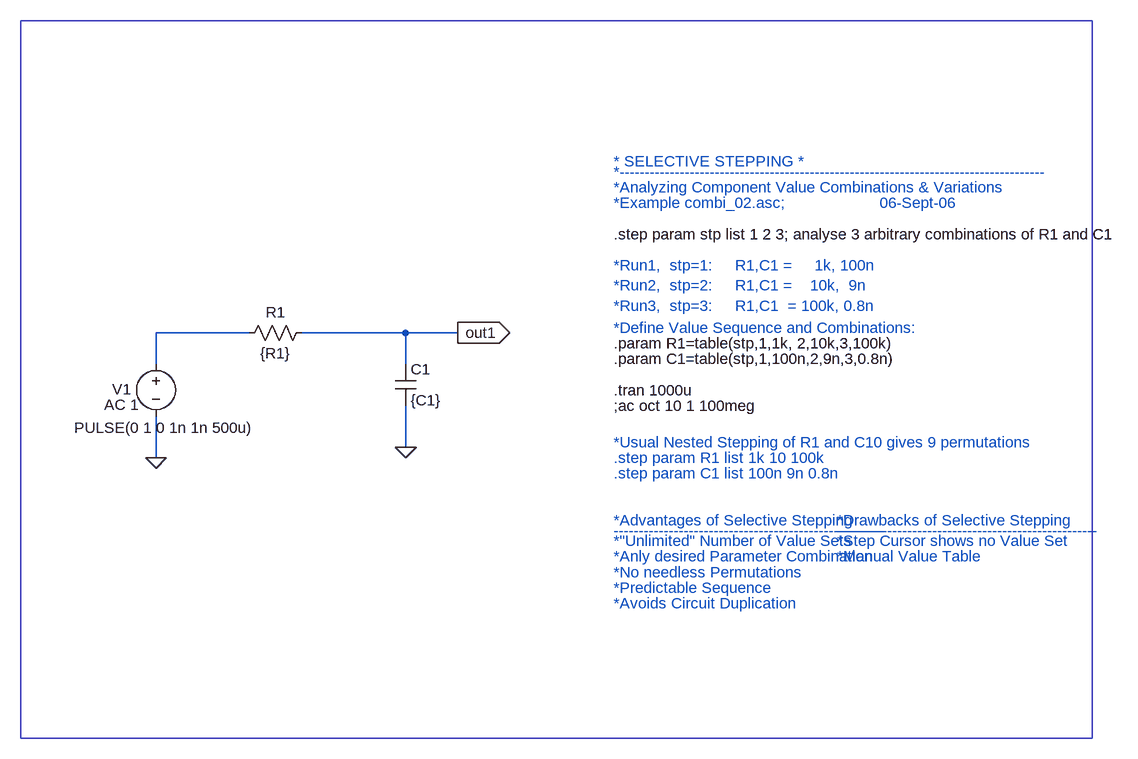
[diagram p0: schematic combi_02.asc]
combi_02.asc, the LTspice schematic file:
Version 4
SHEET 1 1020 768
WIRE -832 -64 -976 -64
WIRE -592 -64 -752 -64
WIRE -512 -64 -592 -64
WIRE -976 -16 -976 -64
WIRE -592 -16 -592 -64
WIRE -592 112 -592 48
WIRE -976 128 -976 64
FLAG -976 128 0
FLAG -512 -64 out1
IOPIN -512 -64 Out
FLAG -592 112 0
SYMBOL res -848 -48 R270
WINDOW 0 32 56 VTop 0
WINDOW 3 0 56 VBottom 0
SYMATTR InstName R1
SYMATTR Value {R1}
SYMBOL cap -608 -16 R0
SYMATTR InstName C1
SYMATTR Value {C1}
SYMBOL voltage -976 -32 R0
WINDOW 0 -67 55 Left 0
WINDOW 3 -126 114 Left 0
WINDOW 123 -80 79 Left 0
WINDOW 39 0 0 Left 0
SYMATTR InstName V1
SYMATTR Value PULSE(0 1 0 1n 1n 500u)
SYMATTR Value2 AC 1
TEXT -272 -216 Left 0 !.step param stp list 1 2 3; analyse 3 arbitrary combinations of R1 and C1
TEXT -272 24 Left 0 !.tran 1000u
TEXT -272 -48 Left 0 !.param R1=table(stp,1,1k, 2,10k,3,100k)
TEXT -272 -24 Left 0 !.param C1=table(stp,1,100n,2,9n,3,0.8n)
TEXT -272 -288 Left 0 ;*Analyzing Component Value Combinations & Variations
TEXT -272 128 Left 0 ;.step param R1 list 1k 10 100k
TEXT -272 152 Left 0 ;.step param C1 list 100n 9n 0.8n
TEXT -272 104 Left 0 ;*Usual Nested Stepping of R1 and C10 gives 9 permutations
TEXT -272 -264 Left 0 ;*Example combi_02.asc;                     06-Sept-06
TEXT -272 -168 Left 0 ;*Run1,  stp=1:     R1,C1 =     1k, 100n\n*Run2,  stp=2:     R1,C1 =    10k,  9n\n*Run3,  stp=3:     R1,C1  = 100k, 0.8n
TEXT -272 -72 Left 0 ;*Define Value Sequence and Combinations:
TEXT -272 48 Left 0 !;ac oct 10 1 100meg
TEXT -272 224 Left 0 ;*Advantages of Selective Stepping
TEXT 72 224 Left 0 ;*Drawbacks of Selective Stepping
TEXT -272 304 Left 0 ;*No needless Permutations
TEXT -272 256 Left 0 ;*"Unlimited" Number of Value Sets
TEXT 72 256 Left 0 ;*Step Cursor shows no Value Set
TEXT -272 280 Left 0 ;*Anly desired Parameter Combination
TEXT 72 280 Left 0 ;*Manual Value Table
TEXT -272 328 Left 0 ;*Predictable Sequence
TEXT -272 -328 Left 0 ;* SELECTIVE STEPPING *
TEXT -272 352 Left 0 ;*Avoids Circuit Duplication
TEXT -272 -312 Left 0 ;*-------------------------------------------------------------------------------------
TEXT -272 240 Left 0 ;------------------------------------------------------
TEXT 72 240 Left 0 ;----------------------------------------------------
RECTANGLE Normal 464 560 -1184 -544

The netlist it stands for:
* combi_02.asc
R1 N001 out1 {R1}
C1 out1 0 {C1}
V1 N001 0 PULSE(0 1 0 1n 1n 500u) AC 1
.step param stp list 1 2 3; analyse 3 arbitrary combinations of R1 and C1
.tran 1000u
.param R1=table(stp,1,1k, 2,10k,3,100k)
.param C1=table(stp,1,100n,2,9n,3,0.8n)
* *Analyzing Component Value Combinations & Variations
* .step param R1 list 1k 10 100k
* .step param C1 list 100n 9n 0.8n
* *Usual Nested Stepping of R1 and C10 gives 9 permutations
* *Example combi_02.asc;                     06-Sept-06
* *Run1,  stp=1:     R1,C1 =     1k, 100n
* *Run2,  stp=2:     R1,C1 =    10k,  9n
* *Run3,  stp=3:     R1,C1  = 100k, 0.8n
* *Define Value Sequence and Combinations:
;ac oct 10 1 100meg
* *Advantages of Selective Stepping
* *Drawbacks of Selective Stepping
* *No needless Permutations
* *"Unlimited" Number of Value Sets
* *Step Cursor shows no Value Set
* *Anly desired Parameter Combination
* *Manual Value Table
* *Predictable Sequence
* * SELECTIVE STEPPING *
* *Avoids Circuit Duplication
* *-------------------------------------------------------------------------------------
* ------------------------------------------------------
* ----------------------------------------------------
.backanno
.end